# EAGLE schematic schemat (EAGLE 9.6.2)
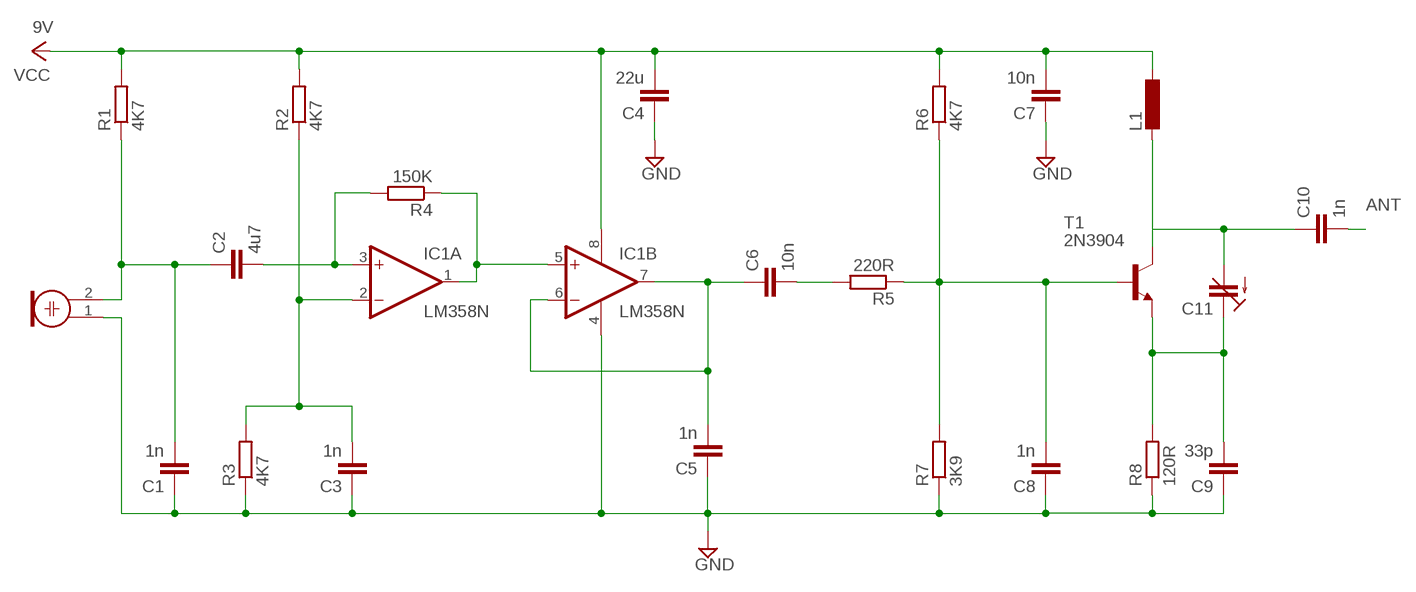
[diagram p0: schematic, sheet 1]

## Parts
C1  1n  C-EU025-025X050  [C025-025X050]
C2  4u7  C-EU025-025X050  [C025-025X050]
C3  1n  C-EU025-025X050  [C025-025X050]
C4  22u  C-EU025-025X050  [C025-025X050]
C5  1n  C-EU025-025X050  [C025-025X050]
C6  10n  C-EU025-025X050  [C025-025X050]
C7  10n  C-EU025-025X050  [C025-025X050]
C8  1n  C-EU025-025X050  [C025-025X050]
C9  33p  C-EU025-025X050  [C025-025X050]
C10  1n  C-EU025-025X050  [C025-025X050]
C11  C-TRIMM3040.428  [CTRIM3040.428]
IC1  LM358N  [DIL08]
L1  L-EU0207/15  [0207/15]
M1  ELECTRET_MICROPHON-F6050AP  [F6050AP]
R1  4K7  R-EU_0204/7  [0204/7]
R2  4K7  R-EU_0204/7  [0204/7]
R3  4K7  R-EU_0204/7  [0204/7]
R4  150K  R-EU_0204/7  [0204/7]
R5  220R  R-EU_0204/7  [0204/7]
R6  4K7  R-EU_0204/7  [0204/7]
R7  3K9  R-EU_0204/7  [0204/7]
R8  120R  R-EU_0204/7  [0204/7]
T1  2N3904  [TO92]

## Nets
9V: C4.2 C7.2 IC1.8(P:V+) L1.1 R1.2 R2.2 R6.2 ; supply symbol labelled VCC
ANT: C10.2
GND: C1.1 C3.1 C4.1 C5.1 C7.1 C8.1 C9.1 IC1.4(P:V-) M1.1 R3.1 R7.1 R8.1
N$1: C2.2 IC1.3(A:+IN) R4.2
N$2: IC1.1(A:OUT) IC1.5(B:+IN) R4.1
N$4: C1.2 C2.1 M1.2 R1.1
N$5: C8.2 R5.1 R6.1 R7.2 T1.2(B)
N$6: C3.2 IC1.2(A:-IN) R2.1 R3.2
N$7: C6.2 R5.2
N$9: C10.1 C11.2(A) L1.2 T1.1(C)
N$10: C5.2 C6.1 IC1.6(B:-IN) IC1.7(B:OUT)
N$12: C9.2 C11.1A(E) R8.2 T1.3(E)

## Library data of the parts
C1-C10 = rcl:C-EU: CAPACITOR, European symbol; SPICEPREFIX: C
C11 = rcl:C-TRIMM: Trimm capacitor; SPICEPREFIX: C
IC1 = linear:LM358: OP AMP also LM158; LM258; LM2904 Source: http://cache.national.com/ds/LM/LM158.pdf
L1 = rcl:L-EU: INDUCTOR, European symbol; SPICEPREFIX: L
M1 = microphon:ELECTRET_MICROPHON-: Electret Condenser Microphone
R1-R8 = rcl:R-EU_: RESISTOR, European symbol; SPICEPREFIX: R
T1 = transistor:2N3904: NPN TRANSISTOR